# EAGLE design FFC_Adapters_10 (EAGLE 6.6.0)
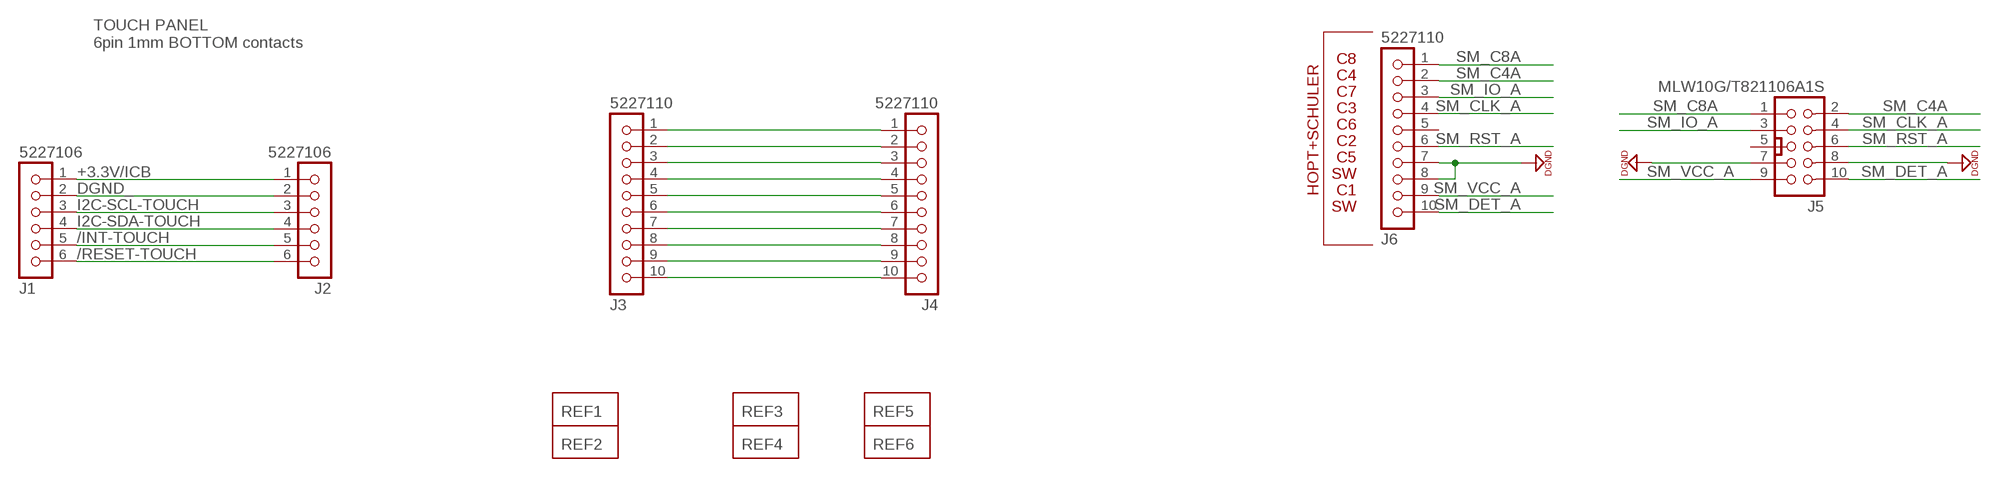
[diagram p0: schematic, sheet 1]

## Parts
J1  5227106  5227106/1.LEFT  [5227106/1.LEFT]
J2  5227106  5227106/1.RIGHT  [5227106/1.RIGHT]
J3  5227110  5227110/1.LEFT  [5227110/1.LEFT]
J4  5227110  5227110/1.RIGHT  [5227110/1.RIGHT]
J5  MLW10G/T821106A1S  [MLW10-5X2-PRIMY]
J6  5227110  5227110/1.RIGHT  [5227110/1.RIGHT]
REF1  REF  [REF]
REF2  REF  [REF]
REF3  REF  [REF]
REF4  REF  [REF]
REF5  REF  [REF]
REF6  REF  [REF]

## Nets
+3.3V/ICB: J1.1 J2.1
/INT-TOUCH: J1.5 J2.5
/RESET-TOUCH: J1.6 J2.6
DGND: J5.7 J5.8 J6.7 J6.8
DGND_: J1.2 J2.2
I2C-SCL-TOUCH: J1.3 J2.3
I2C-SDA-TOUCH: J1.4 J2.4
N$1: J3.1 J4.1
N$2: J3.2 J4.2
N$3: J3.3 J4.3
N$4: J3.4 J4.4
N$5: J3.5 J4.5
N$6: J3.6 J4.6
N$7: J3.7 J4.7
N$8: J3.8 J4.8
N$9: J3.9 J4.9
N$10: J3.10 J4.10
SM_C4A: J5.2 J6.2
SM_C8A: J5.1 J6.1
SM_CLK_A: J5.4 J6.4
SM_DET_A: J5.10 J6.10
SM_IO_A: J5.3 J6.3
SM_RST_A: J5.6 J6.6
SM_VCC_A: J5.9 J6.9
Unconnected: J5.5 J6.5

## Notes on the sheet
- TOUCH PANEL
  6pin 1mm BOTTOM contacts
- C8
- C4
- C7
- C3
- C6
- C2
- C5
- SW
- HOPT+SCHULER | C1
- SW

## Library data of the parts
J1 J2 = CON-Hirose-AON:5227106: FFC connector 6pin bottom 1,0mm slide lock
J3 J4 J6 = CON-Hirose-AON:5227110: FFC connector 10pin bottom 1,0mm slide lock
J5 = CON-pinHeader-AON:MLW10G/T821106A1S: konektor 5x2 primy, GME MLW10G, TME Farnel RS T821106A1S Amphenol, Digi OnShore 302-S101
REF1-REF6 = technol:REF

## Board
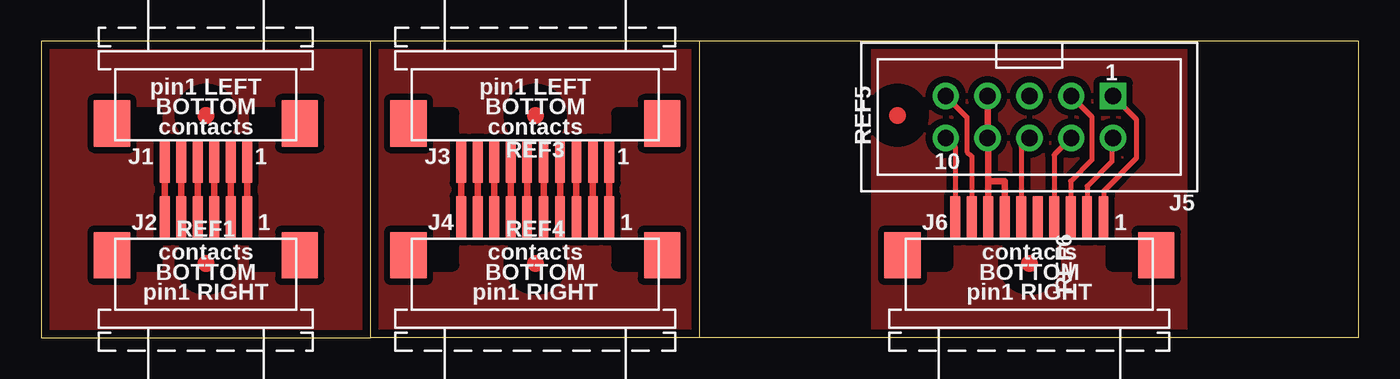
[diagram p1: board, top side]
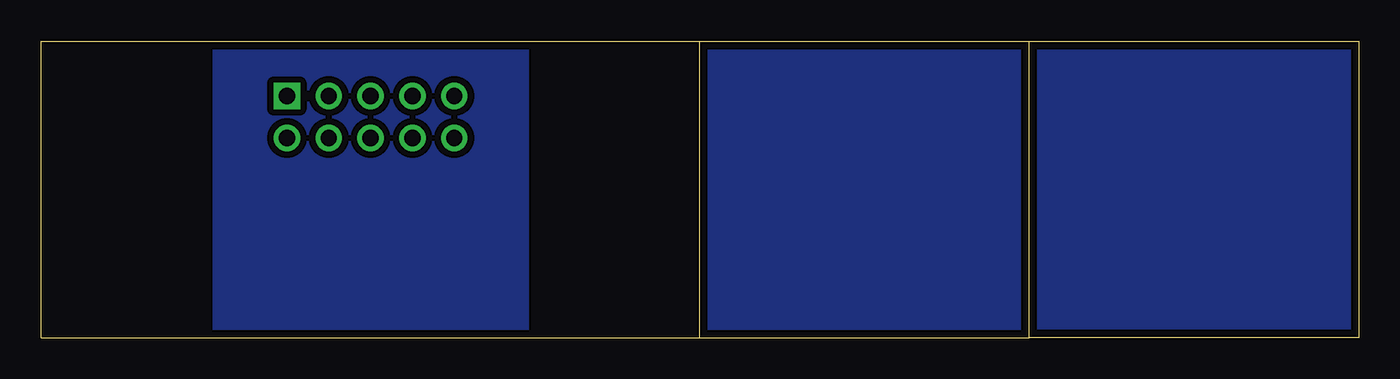
[diagram p2: board, bottom side, seen from below]

Size 80 x 18 mm. Coordinates in mm from the lower left corner, seen from the top.
Outline: 20,18 0,18 0,0 20,0
Outline: 20,0 20,18
Outline: 40,18 20,18
Outline: 40,18 80,18 80,0 40,0
Outline: 40,0 20,0
Outline: 40,0 40,18
Copper layers (1*16): Top 0.035mm / dielectric 1.5mm / Bottom 0.035mm
Design rules "ELOCK-ICBE": minimum track width 0.2mm, minimum drill 0.3mm, track to track 0.2mm, track to pad 0.2mm, pad to pad 0.2mm, via to via 0.2mm, smd to smd 0.001mm, copper to edge 0.49mm, drill to drill 0.2mm, minimum pad ring 0.3mm, minimum via ring 0.25mm, stop-mask expansion 0.1mm, vias tented up to drill 0.6mm, thermal gap 0.27mm

### Footprints (pad centres in the part's own frame; a part is rotated, then mirrored left to right if it is on the bottom)
5227106/1.LEFT = smd 0.6 x 2.6: 1 -2.5,3.3; 2 -1.5,3.3; 3 -0.5,3.3; 4 0.5,3.3; 5 1.5,3.3; 6 2.5,3.3 | smd 2.2 x 2.8: C1 -5.7,1; C2 5.7,1
5227106/1.RIGHT = smd 0.6 x 2.6: 1 2.5,3.3; 2 1.5,3.3; 3 0.5,3.3; 4 -0.5,3.3; 5 -1.5,3.3; 6 -2.5,3.3 | smd 2.2 x 2.8: C1 -5.7,1; C2 5.7,1
5227110/1.LEFT = smd 0.6 x 2.6: 1 -4.5,3.3; 2 -3.5,3.3; 3 -2.5,3.3; 4 -1.5,3.3; 5 -0.5,3.3; 6 0.5,3.3; 7 1.5,3.3; 8 2.5,3.3; 9 3.5,3.3; 10 4.5,3.3 | smd 2.2 x 2.8: C1 -7.7,1; C2 7.7,1
5227110/1.RIGHT = smd 0.6 x 2.6: 1 4.5,3.3; 2 3.5,3.3; 3 2.5,3.3; 4 1.5,3.3; 5 0.5,3.3; 6 -0.5,3.3; 7 -1.5,3.3; 8 -2.5,3.3; 9 -3.5,3.3; 10 -4.5,3.3 | smd 2.2 x 2.8: C1 -7.7,1; C2 7.7,1
MLW10-5X2-PRIMY = drill 1 pad 1.6 square: 1 -5.08,-1.27 | drill 1 pad 1.6: 2 -5.08,1.27; 3 -2.54,-1.27; 4 -2.54,1.27; 5 0,-1.27; 6 0,1.27; 7 2.54,-1.27; 8 2.54,1.27; 9 5.08,-1.27; 10 5.08,1.27

### Placement (x,y rotation side)
J1  10,14 180 top
J2  10,4 0 top
J3  30,14 180 top
J4  30,4 0 top
J5  60,13.4 180 top
J6  60,4 0 top
REF1  10,4.5 0 top
REF2  10,13.5 180 top
REF3  30,13.5 180 top
REF4  30,4.5 0 top
REF5  52,13.5 90 top
REF6  60,4.5 270 top

### Tracks (layer width: path | path; a pad name or v marks a point on that pad's centre or on a via)
+3.3V/ICB
  Top 0.4: J1.1 J2.1
/INT-TOUCH
  Top 0.4: J1.5 J2.5
/RESET-TOUCH
  Top 0.4: J1.6 J2.6
DGND
  Top 0.4: J5.7 J5.8 57.5,12.09 57.5,9.5 | J6.8 57.5,9.5 | J6.7 58.5,9.5 57.5,9.5
DGND_
  Top 0.4: J1.2 J2.2
I2C-SCL-TOUCH
  Top 0.4: J1.3 J2.3
I2C-SDA-TOUCH
  Top 0.4: J1.4 J2.4
N$1
  Top 0.4: J3.1 J4.1
N$2
  Top 0.4: J3.2 J4.2
N$3
  Top 0.4: J3.3 J4.3
N$4
  Top 0.4: J3.4 J4.4
N$5
  Top 0.4: J3.5 J4.5
N$6
  Top 0.4: J3.6 J4.6
N$7
  Top 0.4: J3.7 J4.7
N$8
  Top 0.4: J3.8 J4.8
N$9
  Top 0.4: J3.9 J4.9
N$10
  Top 0.4: J3.10 J4.10
N$11
  pour Bottom (isolate 0.4): 0.5,17.5 19.5,17.5 19.5,0.5 0.5,0.5
N$12
  pour Top (isolate 0.4): 0.5,17.5 19.5,17.5 19.5,0.5 0.5,0.5
N$13
  pour Top (isolate 0.4): 20.5,17.5 39.5,17.5 39.5,0.5 20.5,0.5
N$14
  pour Bottom (isolate 0.4): 20.5,17.5 39.5,17.5 39.5,0.5 20.5,0.5
N$15
  pour Bottom (isolate 0.4): 50.5,17.5 69.5,17.5 69.5,0.5 50.5,0.5
N$16
  pour Top (isolate 0.4): 50.5,17.5 69.5,17.5 69.5,0.5 50.5,0.5
SM_C4A
  Top 0.3: J5.2 65,12.05 65,10.7 63.5,9.2 J6.2
SM_C8A
  Top 0.3: J5.1 66.5,13.25 66.5,10.9 64.5,8.9 J6.1
SM_CLK_A
  Top 0.3: J5.4 61.5,11.09 J6.4
SM_DET_A
  Top 0.3: J5.10 55.5,11.55 J6.10
SM_IO_A
  Top 0.3: J5.3 63.8,13.41 63.8,10.8 62.5,9.5 J6.3
SM_RST_A
  Top 0.3: J5.6 59.5,11.63 J6.6
SM_VCC_A
  Top 0.3: J5.9 56.2,13.39 56.2,11.3 56.5,11 J6.9